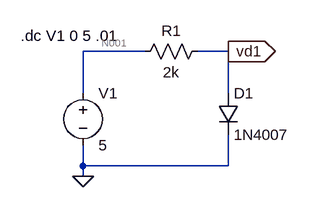
[diagram p0: schematic exam1_10.asc]
exam1_10.asc, the LTspice schematic file:
Version 4
SHEET 1 880 680
WIRE 192 80 96 80
WIRE 320 80 272 80
WIRE 96 144 96 80
WIRE 320 144 320 80
WIRE 96 256 96 224
WIRE 320 256 320 208
WIRE 320 256 96 256
WIRE 96 272 96 256
FLAG 96 272 0
FLAG 320 80 vd1
IOPIN 320 80 Out
SYMBOL voltage 96 128 R0
SYMATTR InstName V1
SYMATTR Value 5
SYMBOL res 288 64 R90
WINDOW 0 0 56 VBottom 2
WINDOW 3 32 56 VTop 2
SYMATTR InstName R1
SYMATTR Value 2k
SYMBOL diode 304 144 R0
SYMATTR InstName D1
SYMATTR Value 1N4007
TEXT 0 56 Left 2 !.dc V1 0 5 .01

The netlist it stands for:
* exam1_10.asc
V1 N001 0 5
R1 vd1 N001 2k
D1 vd1 0 1N4007
.model D D
.lib standard.dio
.dc V1 0 5 .01
.backanno
.end

* Results of the author's LTspice run, read from the files saved beside the schematic
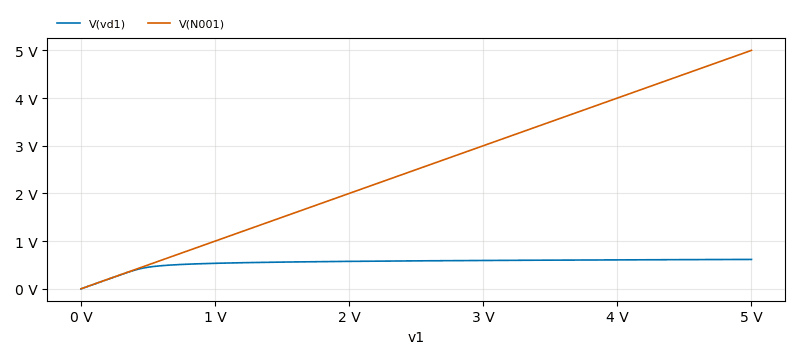
[diagram p1: DC transfer characteristic of exam1_10.asc, plotted from the saved traces]
* DC transfer characteristic, 1 run:
*   V(vd1): 0 V at v1=0 V, 616 mV at v1=5 V, min 0 V, max 616 mV
*   V(N001): 0 V at v1=0 V, 5 V at v1=5 V, min 0 V, max 5 V